# Altium project BuckConverter.PrjPcb
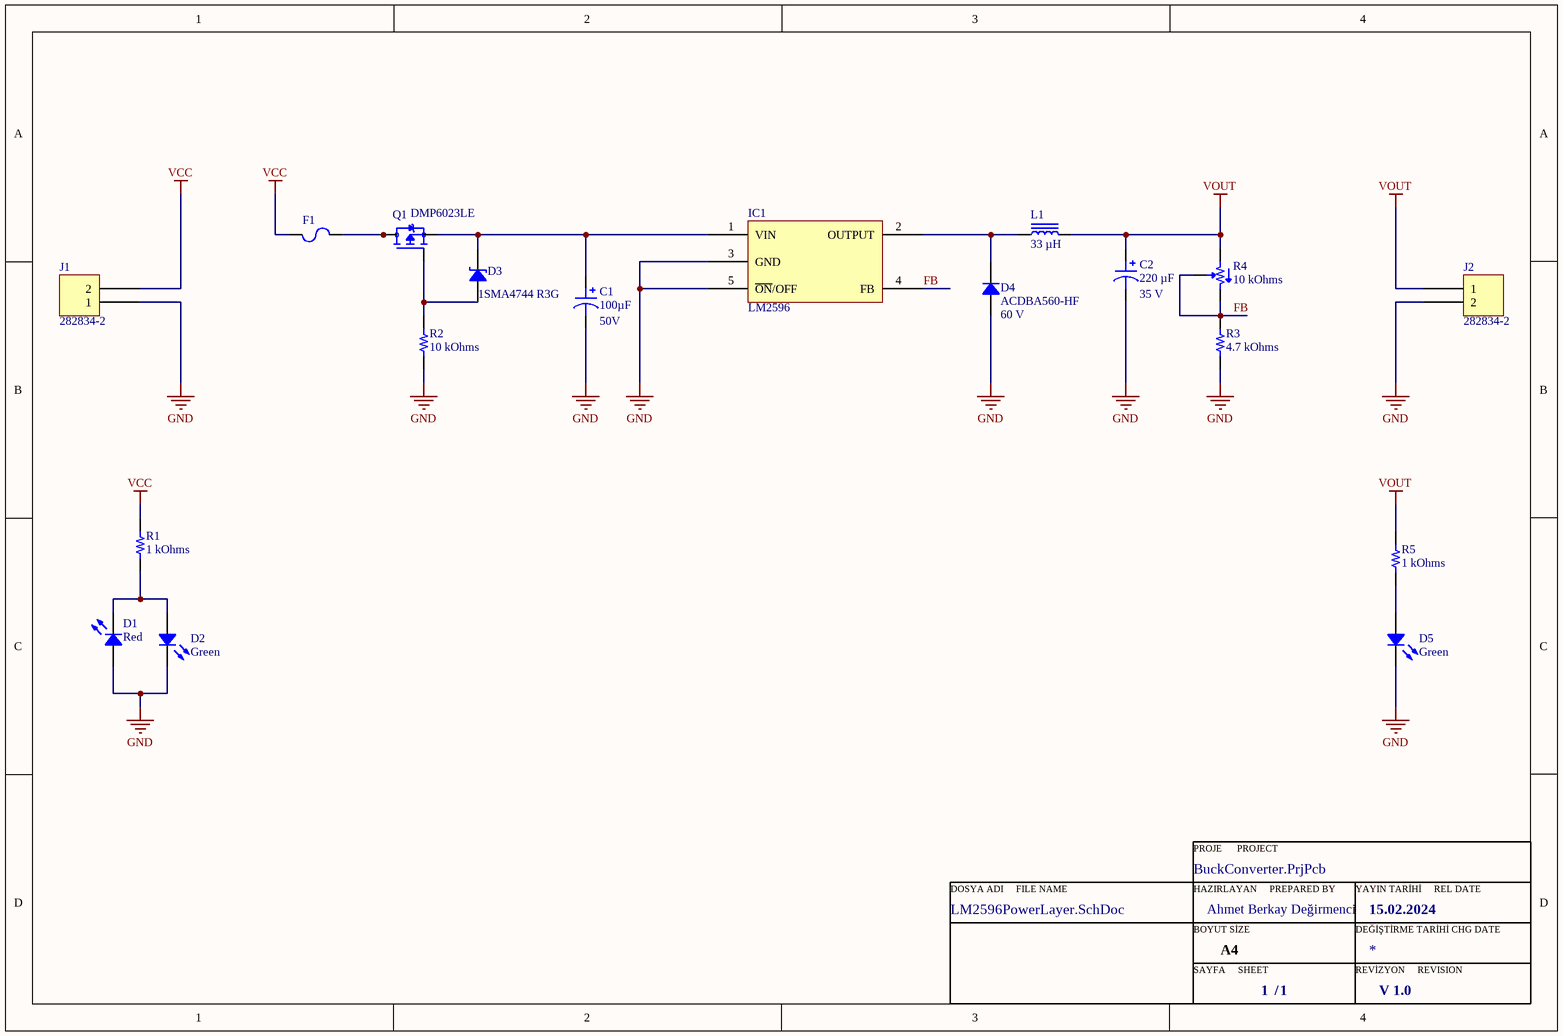
[diagram p0: LM2596PowerLayer.SchDoc]
1 sheet, 18 parts. Net scope: global (net labels, ports and power ports of the same name join across sheets).
Board file: LM2596.PcbDoc

## Sheet LM2596PowerLayer.SchDoc
size A4; Date: 15.02.2024; Engineer: Ahmet Berkay Değirmenci; Revision: V 1.0; SheetNumber: 1; SheetTotal: 1

### Parts
C1  100µF  Voltage - Rated: 50V  [CAP ALSMD 8.3MM H10.5MM]
C2  220 µF  Voltage - Rated: 35 V  [CAP ALSMD 8.3MM H10.5MM]
D1  Red  [LED 0805_2012 RED]
D2  Green  [LED 0805_2012 GREEN]
D3  1SMA4744 R3G  [DO214AC SMA]
D4  ACDBA560-HF  Voltage - DC Reverse (Vr) (Max): 60 V  [DO214AC SMA]
D5  Green  [LED 0805_2012 GREEN]
F1  (no value)  [FUSE 1206_3216 0.6MM]
IC1  LM2596  [D2PAK]
J1  282834-2  [TE 282834-2]
J2  282834-2  [TE 282834-2]
L1  33 µH  [BOURNS SRR1280]
Q1  DMP6023LE  [SOT223]
R1  1 kOhms  [RES 0805_2012]
R2  10 kOhms  [RES 0805_2012]
R3  4.7 kOhms  [RES 0805_2012]
R4  10 kOhms  [BOURNS TRIMPOT 3296W]
R5  1 kOhms  [RES 0805_2012]

### Nets
GND: C1.2 C2.2 D1.1 D2.2 D4.1 D5.2 IC1.3(GND) IC1.5(~{ON}/OFF) J1.1 J2.2 R2.1 R3.2
VCC: F1.1 J1.2 R1.2
VOUT: C2.1 J2.1 L1.2 R4.1 R5.2
FB: IC1.4(FB) R3.1 R4.2 R4.3
NetC1_1: C1.1 D3.2 IC1.1(VIN) Q1.3(S)
NetD1_2: D1.2 D2.1 R1.1
NetD3_1: D3.1 Q1.1(G) R2.2
NetD4_2: D4.2 IC1.2(OUTPUT) L1.1
NetD5_1: D5.1 R5.1
NetF1_2: F1.2 Q1.2(D) Q1.4(D)

### Notes on the sheet
- PROJE      PROJECT
- DOSYA ADI     FILE NAME
- HAZIRLAYAN     PREPARED BY
- YAYIN TARİHİ     REL DATE
- BOYUT SİZE
- SAYFA     SHEET
- A4
- /
- DEĞİŞTİRME TARİHİ CHG DATE
- REVİZYON     REVISION
- Text

### Library data of the parts
C1 = UUR1H101MNL6GS: CAP ALUM 100UF 20% 50V SMD; manufacturer: Nichicon; Lifetime @ Temp.: 2000 Hrs @ 85°C; Ripple Current @ High Frequency: 235.3mA @ 10kHz; Ripple Current @ Low Frequency: 181mA @ 120Hz; Surface Mount Land Size: 0.327" L x 0.327" W (8.30mm x 8.30mm); Part Number: UUR1H101MNL6GS; Applications: General Purpose; Capacitance: 100µF; componentlink1description: Datasheet; componentlink1url: http://nichicon-us.com/english/products/pdfs/e-uur.pdf; componentlink2description: DigiKey Link; componentlink2url: http://digikey.com/product-detail/en/nichicon/UUR1H101MNL6GS/493-6227-1-ND/3438740; Device Package: Radial, Can - SMD; Height - Seated (Max): 0.413" (10.50mm); lastupdated: 2.09.2020 01:25:15; Lifecycle Status: Active; Minimum Order: 1; Mounting Type: Surface Mount; Operating Temperature: -40°C ~ 85°C; Package / Case: Radial, Can - SMD; packaging: TapeAndReel; partid: 7573; Part Status: Active; price: 0.21; series: UUR; Size / Dimension: 0.315" Dia (8.00mm); Supplier 1: DigiKey; Supplier Part Number 1: 493-6227-1-ND; Tolerance: ±20%; value: 100µF
C2 = 35TZV220M8X10.5: CAP ALUM 220UF 20% 35V SMD; manufacturer: Rubycon; Impedance: 160 mOhms; Lifetime @ Temp.: 2000 Hrs @ 105°C; Polarization: Polar; Ripple Current @ High Frequency: 600 mA @ 100 kHz; Ripple Current @ Low Frequency: 360 mA @ 120 Hz; Surface Mount Land Size: 0.327" L x 0.327" W (8.30mm x 8.30mm); Part Number: 35TZV220M8X10.5; Applications: Automotive; Capacitance: 220 µF; componentlink1description: Datasheet; componentlink1url: http://www.rubycon.co.jp/en/catalog/e_pdfs/aluminum/e_tzv.pdf; componentlink2description: DigiKey Link; componentlink2url: https://www.digikey.com/en/products/detail/rubycon/35TZV220M8X10-5/3134902; Device Package: Radial, Can - SMD; Height - Seated (Max): 0.413" (10.50mm); lastupdated: 8.02.2024 21:46:37; Lifecycle Status: Active; Minimum Order: 1; Mounting Type: Surface Mount; Operating Temperature: -55°C ~ 105°C; Package / Case: Radial, Can - SMD; packaging: TapeAndReel; partid: 7540; Part Status: Active; price: 0.15; Ratings: AEC-Q200; series: TZV; Size / Dimension: 0.315" Dia (8.00mm); Supplier 1: DigiKey; Supplier Part Number 1: 1189-1622-1-ND; Tolerance: ±20%; value: 220 µF
D1 = 5990110007F: LED RED 0805 SMD; Manufacturer: Dialight; Configuration: Standard; Current - Test: 20mA; Lens Color: 0.80mm; Lens Size: 1.40mm x 1.25mm; Lens Style: Rectangle with Flat Top; Millicandela Rating: 29mcd; Viewing Angle: 140°; Voltage - Forward (Vf) (Typ): 2.1V; Wavelength - Dominant: 633nm; Part Number: 5990110007F; Color: Red; ComponentLink1Description: Datasheet; ComponentLink1URL: http://www.dialightsignalsandcomponents.com/Assets/Brochures_And_Catalogs/Indication/CBI_SMD_new/Dialight_CBI_data_599-0805_Apr2018.pdf; ComponentLink2Description: DigiKey Link; ComponentLink2URL: https://www.digikey.com/en/products/detail/dialight/5990110007F/9385408; Device Package: 0805 (2012 Metric); Height (Max): 0.80mm; LastUpdated: 8.02.2024 21:32:36; Lifecycle Status: Active; Minimum Order: 1; Mounting Type: Surface Mount; Package / Case: 0805 (2012 Metric); Packaging: TapeAndReel; PartId: 308; Part Status: Active; Price: 0.04; Series: 599; Size / Dimension: 2.00mm L x 1.25mm W; Supplier 1: DigiKey; Supplier Part Number 1: 350-4353-1-ND; Supplier Device Package: 0805; Value: Red
D2 D5 = APHCM2012CGCK-F01: LED GREEN CLEAR CHIP SMD; Manufacturer: Kingbright; Configuration: Standard; Current - Test: 20mA; Lens Color: Colorless; Lens Size: 1.30mm x 1.25mm; Lens Style: Rectangle with Flat Top; Millicandela Rating: 50mcd; Viewing Angle: 110°; Voltage - Forward (Vf) (Typ): 2.1V; Wavelength - Dominant: 570nm; Wavelength - Peak: 574nm; Part Number: APHCM2012CGCK-F01; Color: Green; ComponentLink1Description: Datasheet; ComponentLink1URL: http://www.kingbrightusa.com/images/catalog/SPEC/APHCM2012CGCK-F01.pdf; ComponentLink2Description: DigiKey Link; ComponentLink2URL: https://www.digikey.com/en/products/detail/kingbright/APHCM2012CGCK-F01/1747492; Device Package: 0805 (2012 Metric); Height (Max): 0.40mm; LastUpdated: 8.02.2024 21:32:59; Lens Transparency: Clear; Lifecycle Status: Active; Minimum Order: 1; Mounting Type: Surface Mount; Package / Case: 0805 (2012 Metric); Packaging: TapeAndReel; PartId: 241; Part Status: Active; Price: 0.05; Series: -; Size / Dimension: 2.00mm L x 1.25mm W; Supplier 1: DigiKey; Supplier Part Number 1: 754-1094-1-ND; Supplier Device Package: Chip LED; Value: Green
D3 = 1SMA4744 R3G: DIODE ZENER 15V 1.25W DO214AC; Manufacturer: Taiwan Semiconductor Corporation; Current - Reverse Leakage @ Vr: 1µA @ 11.4V; Impedance (Max) (Zzt): 14 Ohms; Tolerance: ±5%; Part Number: 1SMA4744 R3G; ComponentLink1Description: Datasheet; ComponentLink1URL: https://www.taiwansemi.com/products/datasheet/1SMA4737%20SERIES_O15.pdf; ComponentLink2Description: DigiKey Link; ComponentLink2URL: http://digikey.com/product-detail/en/taiwan-semiconductor-corporation/1SMA4744-R3G/1SMA4744R3GCT-ND/7357092; LastUpdated: 8.02.2024 21:28:06; Lifecycle Status: Active; Minimum Order: 1; Mounting Type: Surface Mount; Operating Temperature: -55°C ~ 175°C (TJ); Package / Case: DO-214AC, SMA; Packaging: TapeAndReel; PartId: 1585; Part Status: Active; Power - Max: 1.25W; Price: 0.09; Series: -; Supplier 1: DigiKey; Supplier Part Number 1: 1SMA4744R3GCT-ND; Supplier Device Package: DO-214AC (SMA); Voltage - Zener (Nom) (Vz): 15V
D4 = ACDBA560-HF: DIODE SCHOTTKY 60V 5A DO214AC; Manufacturer: Comchip Technology; Capacitance @ Vr, F: 250pF @ 4V, 1MHz; Current - Reverse Leakage @ Vr: 500 µA @ 60 V; Speed: Fast Recovery =< 500ns, > 200mA (Io); Voltage - Forward (Vf) (Max) @ If: 700 mV @ 5 A; Part Number: ACDBA560-HF; ComponentLink1Description: Datasheet; ComponentLink1URL: http://www.comchiptech.com/admin/files/product/ACDBA560-HF%20RevA201382.pdf; ComponentLink2Description: DigiKey Link; ComponentLink2URL: https://www.digikey.com/en/products/detail/comchip-technology/ACDBA560-HF/7100903; Current - Average Rectified (Io): 5A; Diode Type: Schottky; LastUpdated: 8.02.2024 21:27:21; Lifecycle Status: Active; Minimum Order: 1; Mounting Type: Surface Mount; Operating Temperature - Junction: -55°C ~ 125°C; Package / Case: DO-214AC, SMA; Packaging: TapeAndReel; PartId: 1832; Part Status: Active; Price: 0.15; Series: -; Supplier 1: DigiKey; Supplier Part Number 1: 641-2078-1-ND; Supplier Device Package: DO-214AC (SMA)
F1 = MFU1206FF04000P100: FUSE BOARD MOUNT 4A 63VDC 1206; Manufacturer: Vishay Beyschlag; Approval Agency: UL; Breaking Capacity @ Rated Voltage: 50A; Fuse Type: Board Mount (Cartridge Style Excluded); Melting I²t: 0.0404; Response Time: Fast Blow; Voltage Rating - DC: 63V; Part Number: MFU1206FF04000P100; Approvals: UL; ComponentLink1Description: Datasheet; ComponentLink1URL: http://www.vishay.com/docs/28747/mfuserie.pdf; ComponentLink2Description: DigiKey Link; ComponentLink2URL: http://digikey.com/product-detail/en/vishay-beyschlag/MFU1206FF04000P100/MFU12064.00CT-ND/1206571; Current Rating (Amps): 4A; Device Package: 1206 (3216 Metric); LastUpdated: 2.09.2020 01:30:46; Lifecycle Status: Active; Minimum Order: 1; Mounting Type: Surface Mount; Operating Temperature: -55°C ~ 125°C; Package / Case: 1206 (3216 Metric); Packaging: TapeAndReel; Part Status: Active; Price: 0.30; Series: MFU; Size / Dimension: 0.126" L x 0.063" W x 0.022" H (3.20mm x 1.60mm x 0.55mm); Supplier 1: DigiKey; Supplier Part Number 1: MFU12064.00CT-ND
J1 J2 = 282834-2: TERM BLK 2P SIDE ENT 2.54MM PCB; Manufacturer: TE Connectivity AMP Connectors; Current: 10A; Mating Orientation: Horizontal with Board; Number of Levels: 1; Pitch: 0.100" (2.54mm); Positions Per Level: 2; Voltage: 150V; Wire Gauge: 16-30 AWG; Wire Termination: Screw - Rising Cage Clamp; Part Number: 282834-2; Color: Green; ComponentLink1Description: Datasheet; ComponentLink1URL: https://www.te.com/commerce/DocumentDelivery/DDEController?Action=srchrtrv&DocNm=282834&DocType=Customer+Drawing&DocLang=English; ComponentLink2Description: DigiKey Link; ComponentLink2URL: http://digikey.com/product-detail/en/te-connectivity-amp-connectors/282834-2/A98333-ND/1150135; LastUpdated: 15.01.2020 04:15:38; Lifecycle Status: Active; Minimum Order: 1; Mounting Type: Through Hole; Packaging: Bulk; Part Status: Active; Price: 0.88; Series: Buchanan; Supplier 1: DigiKey; Supplier Part Number 1: A98333-ND
L1 = SRR1280-330M: FIXED IND 33UH 3.5A 57 MOHM SMD; Manufacturer: Bourns Inc.; Current - Saturation: 3.3A; DC Resistance (DCR): 57mOhm Max; Frequency - Self Resonant: 9.5MHz; Inductance Frequency - Test: 100 kHz; Material - Core: Ferrite; Q @ Freq: 28 @ 2.52MHz; Shielding: Shielded; Tolerance: ±20%; Type: Drum Core, Wirewound; Part Number: SRR1280-330M; ComponentLink1Description: Datasheet; ComponentLink1URL: https://www.bourns.com/docs/Product-Datasheets/SRR1280.pdf; ComponentLink2Description: DigiKey Link; ComponentLink2URL: https://www.digikey.com/en/products/detail/bourns-inc/SRR1280-330M/1969998; Current Rating (Amps): 3.5 A; Device Package: Nonstandard; Height - Seated (Max): 0.315" (8.00mm); Inductance: 33 µH; LastUpdated: 8.02.2024 21:34:54; Lifecycle Status: Active; Minimum Order: 1; Mounting Type: Surface Mount; Operating Temperature: -40°C ~ 125°C; Package / Case: Nonstandard; Packaging: TapeAndReel; PartId: 25; Part Status: Active; Price: 0.51; Series: SRR1280; Size / Dimension: 0.492" L x 0.492" W (12.50mm x 12.50mm); Supplier 1: DigiKey; Supplier Part Number 1: SRR1280-330MCT-ND; Value: 33 µH
Q1 = DMP6023LE: Case: SOT223
R1 R5 = CRCW08051K00JNEAIF: RES SMD 1K OHM 5% 1/8W 0805; Manufacturer: Vishay Dale; Power (Watts): 0.125W, 1/8W; Temperature Coefficient: ±200ppm/°C; Part Number: CRCW08051K00JNEAIF; Value: 1 kOhms; ComponentLink1Description: Datasheet; ComponentLink1URL: http://www.vishay.com/docs/20024/dcrcwife3.pdf; ComponentLink2Description: DigiKey Link; ComponentLink2URL: https://www.digikey.com/en/products/detail/vishay-dale/CRCW08051K00JNEAIF/3477256; Composition: Thick Film; Device Package: 0805 (2012 Metric); Features: Automotive AEC-Q200, Pulse Withstanding; Height - Seated (Max): 0.020" (0.50mm); LastUpdated: 8.02.2024 21:02:27; Lifecycle Status: Active; Minimum Order: 1; Number of Terminations: 2; Operating Temperature: -55°C ~ 155°C; Package / Case: 0805 (2012 Metric); Packaging: TapeAndReel; PartId: 30391; Part Status: Active; Price: 0.08; Ratings: AEC-Q200; Resistance: 1 kOhms; Series: CRCW-IF; Size / Dimension: 0.079" L x 0.049" W (2.00mm x 1.25mm); Supplier 1: DigiKey; Supplier Part Number 1: 541-1.0KAPCT-ND; Supplier Device Package: 0805; Tolerance: ±5%
R2 = LTR10EZPJ103: RES 10K OHM 5% 1/4W 0805 WIDE; Manufacturer: Rohm Semiconductor; Power (Watts): 0.25W, 1/4W; Temperature Coefficient: ±200ppm/°C; Part Number: LTR10EZPJ103; Value: 10 kOhms; ComponentLink1Description: Datasheet; ComponentLink1URL: https://www.rohm.com/datasheet/LTR100JZPD/ltr-e; ComponentLink2Description: DigiKey Link; ComponentLink2URL: https://www.digikey.com/en/products/detail/rohm-semiconductor/LTR10EZPJ103/2708103; Composition: Thick Film; Device Package: 0805 (2012 Metric); Features: Automotive AEC-Q200, Pulse Withstanding; Height - Seated (Max): 0.026" (0.65mm); LastUpdated: 8.02.2024 21:00:46; Lifecycle Status: Active; Minimum Order: 1; Number of Terminations: 2; Operating Temperature: -55°C ~ 155°C; Package / Case: 0805 (2012 Metric); Packaging: TapeAndReel; PartId: 61880; Part Status: Active; Price: 0.02; Ratings: AEC-Q200; Resistance: 10 kOhms; Series: LTR; Size / Dimension: 0.047" L x 0.079" W (1.20mm x 2.00mm); Supplier 1: DigiKey; Supplier Part Number 1: RHM10KBUCT-ND; Supplier Device Package: 0805; Tolerance: ±5%
R3 = RN73R2ATTD4701F50: RES 4.7K OHM 1% 1/8W 0805; Manufacturer: KOA Speer Electronics, Inc.; Power (Watts): 0.125W, 1/8W; Temperature Coefficient: ±50ppm/°C; Part Number: RN73R2ATTD4701F50; Value: 4.7 kOhms; ComponentLink1Description: Datasheet; ComponentLink1URL: https://www.koaspeer.com/pdfs/RN73R.pdf; ComponentLink2Description: DigiKey Link; ComponentLink2URL: https://www.digikey.com/en/products/detail/koa-speer-electronics-inc/RN73R2ATTD4701F50/10033328; Composition: Thin Film; Device Package: 0805 (2012 Metric); Features: Automotive AEC-Q200, Moisture Resistant; Height - Seated (Max): 0.024" (0.60mm); LastUpdated: 8.02.2024 20:59:47; Lifecycle Status: Active; Minimum Order: 1000; Number of Terminations: 2; Operating Temperature: -55°C ~ 155°C; Package / Case: 0805 (2012 Metric); Packaging: TapeAndReel; PartId: 82900; Price: 0.05; Ratings: AEC-Q200; Resistance: 4.7 kOhms; Series: RN73R; Size / Dimension: 0.079" L x 0.049" W (2.00mm x 1.25mm); Supplier 1: DigiKey; Supplier Part Number 1: 2019-RN73R2ATTD4701F50CT-ND; Supplier Device Package: 0805; Tolerance: ±1%
R4 = 3296W-1-103: TRIMMER 10K OHM 0.5W PC PIN TOP; Manufacturer: Bourns Inc.; Adjustment Type: Top Adjustment; Number of Turns: 25; Power (Watts): 0.5W, 1/2W; Resistive Material: Cermet; Temperature Coefficient: ±100ppm/°C; Tolerance: ±10%; Part Number: 3296W-1-103; ComponentLink1Description: Datasheet; ComponentLink1URL: https://www.bourns.com/docs/Product-Datasheets/3296.pdf; ComponentLink2Description: DigiKey Link; ComponentLink2URL: https://www.digikey.com/en/products/detail/bourns-inc/3296W-1-103/84523; LastUpdated: 8.02.2024 21:56:11; Lifecycle Status: Active; Minimum Order: 1; Mounting Type: Through Hole; Packaging: Tube; PartId: 234; Part Status: Active; Price: 1.94; Resistance: 10 kOhms; Series: Trimpot® 3296 - Sealed; Size / Dimension: Rectangular - 0.375" x 0.190" Face (9.53mm x 4.83mm); Supplier 1: DigiKey; Supplier Part Number 1: 3296W-103-ND; Termination Style: PC Pins; Value: 10 kOhms